# Altium schematic sheet 7_kbd.SchDoc
size A
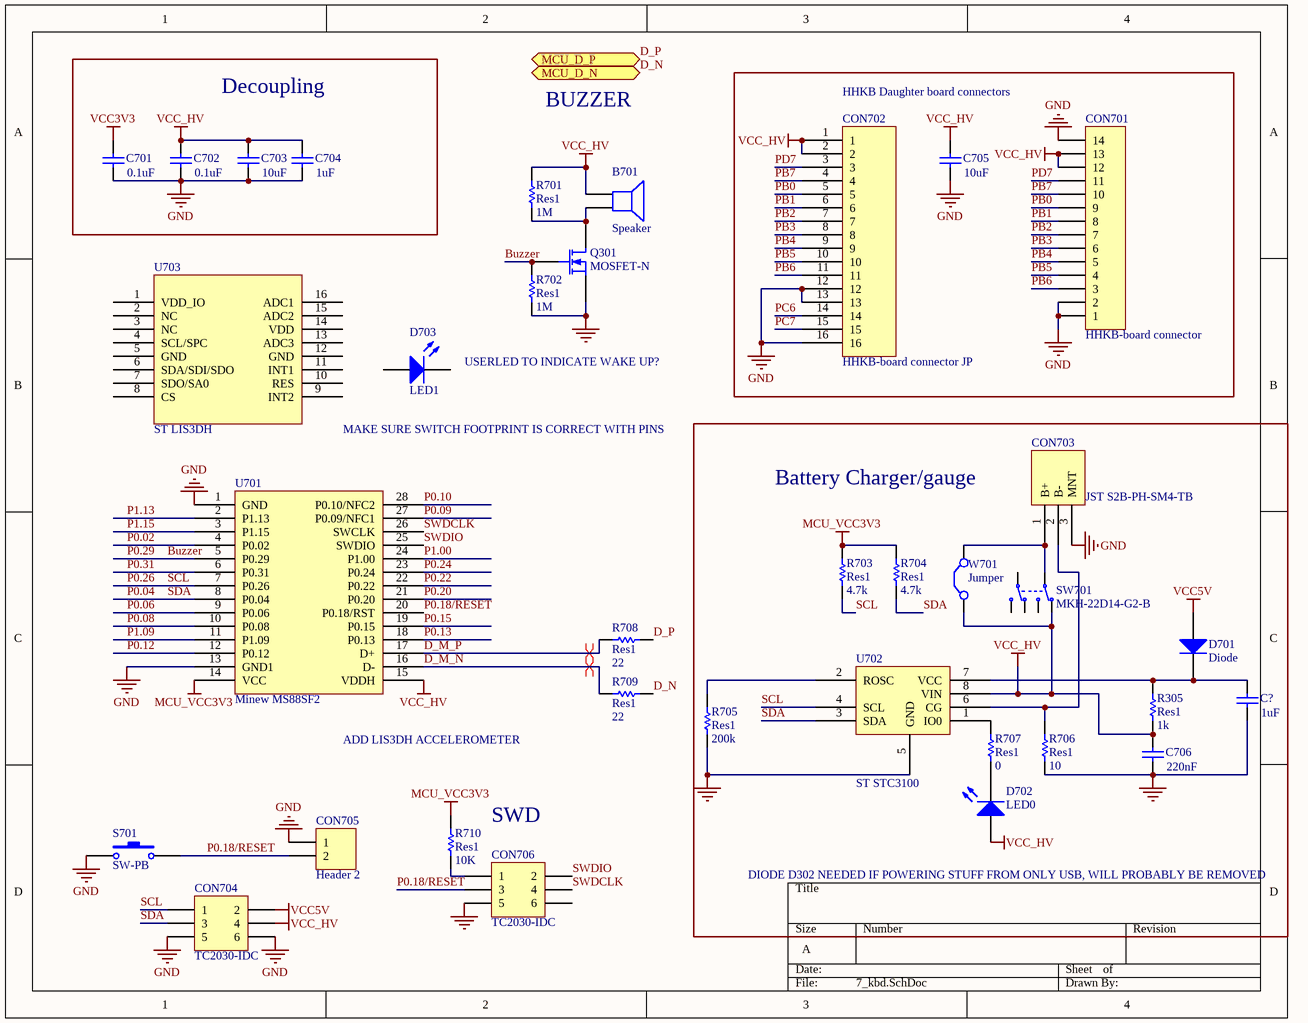
[diagram p0: 7_kbd.SchDoc]

## Parts
B701  Speaker  [buzzer 12x12]
C701  value 0.1uF  [C0603[1608]]
C702  value 0.1uF  [C0603[1608]]
C703  value 10uF  [C1206[3216]]
C704  value 1uF  [C0603[1608]]
C705  value 10uF  [C1206[3216]]
C706  value 220nF  [C0603[1608]]
C?  value 1uF  [C0603[1608]]
CON701  HHKB-board connector  [JST S13B-ZR-SM4A-TF(LF)(SN)]
CON702  HHKB-board connector JP  [DF14A-15P-1.25H]
CON703  JST S2B-PH-SM4-TB  [JST S2B-PH-SM4-TB]
CON704  TC2030-IDC  [TC2030-IDC-NL]  (no BOM)
CON705  Header 2  [HDR1X2]
CON706  TC2030-IDC  [TC2030-IDC-NL]  (no BOM)
D701  Diode  [D0603[1608]]
D702  LED0  [LED0603[1608]]
D703  LED1  [LED-1]
Q301  MOSFET-N  [SOT-23-3]
R305  Res1  value 1k  [R0603[1608]]
R701  Res1  value 1M  [R0603[1608]]
R702  Res1  value 1M  [R0603[1608]]
R703  Res1  value 4.7k  [R0603[1608]]
R704  Res1  value 4.7k  [R0603[1608]]
R705  Res1  value 200k  [R0603[1608]]
R706  Res1  value 10  [R0603[1608]]
R707  Res1  value 0  [R0603[1608]]
R708  Res1  value 22  [R0603[1608]]
R709  Res1  value 22  [R0603[1608]]
R710  Res1  value 10K  [R0603[1608]]
S701  SW-PB  [Wurth 431256038736]
SW701  MKH-22D14-G2-B  [NIDEC CL-SB-22C-02]
U701  Minew MS88SF2  [Minew MS88SF2]
U702  ST STC3100  [STC3100 MiniSO-8]
U703  ST LIS3DH  [ST LIS3DH]
W701  Jumper  [R0603[1608]]

## Blocks framed on the sheet
Decoupling: C701-C704
HHKB Daughter board connectors: C705 CON701 CON702
Battery Charger/gauge: C706 C? CON703 D701 D702 R305 R703-R707 SW701 U702 W701

## Ports
MCU_D_N, MCU_D_P

## Nets
GND: C701.1 C702.1 C703.1 C704.1 C705.1 C706.1 C?.1 CON701.1 CON701.2 CON701.14 CON702.12 CON702.13 CON702.16 CON703.3(MNT) CON704.5 CON704.6 CON705.1 CON706.5 Q301.2(S) R702.2 R705.2 R706.2 S701.2 S701.3(GND) U701.1(GND) U701.13(GND1) U702.5(GND)
MCU_VCC3V3: R703.1 R704.1 R710.1 U701.14(VCC)
VCC3V3: C701.2
VCC5V: CON704.2 D701.1(A)
VCC_HV: B701.1 C702.2 C703.2 C704.2 C705.2 C706.2 CON701.12 CON701.13 CON702.1 CON702.2 CON704.4 D702.1(A) R305.2 R701.1 SW701.3(N.C-1) U701.15(VDDH) U702.8(VIN) W701.1(C1)
Buzzer: Q301.1(G) R702.1 U701.5(P0.29)  [also labelled P0.29]
D_M_N: R709.2 U701.16(D-)
D_M_P: R708.2 U701.17(D+)
D_N: R709.1 ; port MCU_D_N
D_P: R708.1 ; port MCU_D_P
P0.02: U701.4(P0.02)
P0.04: CON704.3 R704.2 U701.8(P0.04) U702.3(SDA)  [also labelled SDA]
P0.06: U701.9(P0.06)
P0.08: U701.10(P0.08)
P0.09: U701.27(P0.09/NFC1)
P0.10: U701.28(P0.10/NFC2)
P0.12: U701.12(P0.12)
P0.13: U701.18(P0.13)
P0.15: U701.19(P0.15)
P0.18/RESET: CON705.2 CON706.3 S701.1 U701.20(P0.18/RST)
P0.20: U701.21(P0.20)
P0.22: U701.22(P0.22)
P0.24: U701.23(P0.24)
P0.26: CON704.1 R703.2 U701.7(P0.26) U702.4(SCL)  [also labelled SCL]
P0.31: U701.6(P0.31)
P1.00: U701.24(P1.00)
P1.09: U701.11(P1.09)
P1.13: U701.2(P1.13)
P1.15: U701.3(P1.15)
PB0: CON701.9 CON702.5
PB1: CON701.8 CON702.6
PB2: CON701.7 CON702.7
PB3: CON701.6 CON702.8
PB4: CON701.5 CON702.9
PB5: CON701.4 CON702.10
PB6: CON701.3 CON702.11
PB7: CON701.10 CON702.4
PC6: CON702.14
PC7: CON702.15
PD7: CON701.11 CON702.3
SWDCLK: CON706.4 U701.26(SWCLK)
SWDIO: CON706.2 U701.25(SWDIO)
NetB701_2: B701.2 Q301.3(D) R701.2
NetC?_2: C?.2 D701.2(K) R305.1 U702.7(VCC)
NetCON703_1: CON703.1(B+) SW701.2(COM-1) W701.2(C2)
NetCON703_2: CON703.2(B-) R706.1 U702.6(CG)
NetCON706_1: CON706.1 R710.2
NetD702_2: D702.2(K) R707.1
NetR705_1: R705.1 U702.2(ROSC)
NetR707_2: R707.2 U702.1(IO0)

Not connected (* = marked no-connect by the designer): CON706 6; D703 1(A) 2(K); SW701 1(N.O-1) 4(N.O-2) 5(COM-2) 6(N.C-2); U703 1(VDD_IO) 2(NC) 3(NC) 4(SCL/SPC) 5(GND) 6(SDA/SDI/SDO) 7(SDO/SA0) 8(CS) 9(INT2) 10(RES) 11(INT1) 12(GND) 13(ADC3) 14(VDD) 15(ADC2) 16(ADC1)

## Layout directives
differential pair: D_M_N, D_M_P

## Notes on the sheet
- BUZZER
- USERLED TO INDICATE WAKE UP?
- MAKE SURE SWITCH FOOTPRINT IS CORRECT WITH PINS
- ADD LIS3DH ACCELEROMETER
- SWD
- DIODE D302 NEEDED IF POWERING STUFF FROM ONLY USB, WILL PROBABLY BE REMOVED

## Library data of the parts
B701 = Speaker: Loudspeaker; LCSC MFG: KELIKING; MFG: Murata Electronics; MFGPN: PKLCS1212E4001-R1; LCSCPN: C201042; MRF.Part: KLJ-1230; Version: 12x12mm buzzer
C701 C702 = Cap: Capacitor; MRF.Part: CC0603KRX7R9BB104; MFG: KEMET; MFGPN: C0603C104M5RACTU; LCSC MFG: YAGEO; Version: 0603 imperial; LCSCPN: C14663
C703-C705 = Cap: Capacitor; MRF.Part: 1206B475K500NT; MFG: KEMET; MFGPN: C0603C104M5RACTU; LCSC MFG: Guangdong Fenghua Advanced Tech; Version: 1206 imperial; LCSCPN: C29823
C706 C? = Cap: Capacitor; Version: 0603 imperial
CON701 = Header 14: MFGPN: S13B-ZR-SM4A-TF(LF)(SN); MFG: JST Sales America Inc
CON702 = DF14A-15P-1.25H: MFG: Hirose Electric Co Ltd; MFGPN: DF14A-15P-1.25H(26)
CON703 = JST S2B-PH-SM4-TB: MFGPN: S2B-PH-SM4-TB(LF)(SN); MFG: JST Sales America Inc.
CON704 CON706 = Header 3X2: Header, 3-Pin, Dual row
CON705 = Header 2: Header, 2-Pin
D701 = Diode: Default Diode; MFG: Bourns Inc.; MFGPN: CD0603-B0340R; Version: 0603 imperial; LCSCPN: C189957
D702 = LED0: Typical INFRARED GaAs LED
D703 = LED1: Typical RED GaAs LED; Published: 8-Jun-2000; LatestRevisionDate: 08-Jul-2005; LatestRevisionNote: Mech Layer 1 removed.; PackageReference: LED-1; Publisher: Altium Limited; PackageDescription: LED; 2 Leads
Q301 = MOSFET-N: N-Channel MOSFET; MFGPN: BSS138; MFG: ON Semiconductor
R305 R703-R709 = Res1: Resistor; Version: 0603 imperial
R701 R702 R710 = Res1: Resistor; MFG: Panasonic Electronic Components; MFGPN: ERJ-3EKF5101V; Version: 0603 imperial
S701 = SW-PB: Switch; MFGPN: 431256038736; MFG: Wurth Electronics Inc
SW701 = MKH-22D14-G2-B: Slide Switch DPDT; Value: MKH-22D14-G2-B
W701 = Jumper: Jumper Wire